# EAGLE design atxmega_e5_breakout_v1 (EAGLE 6.4)
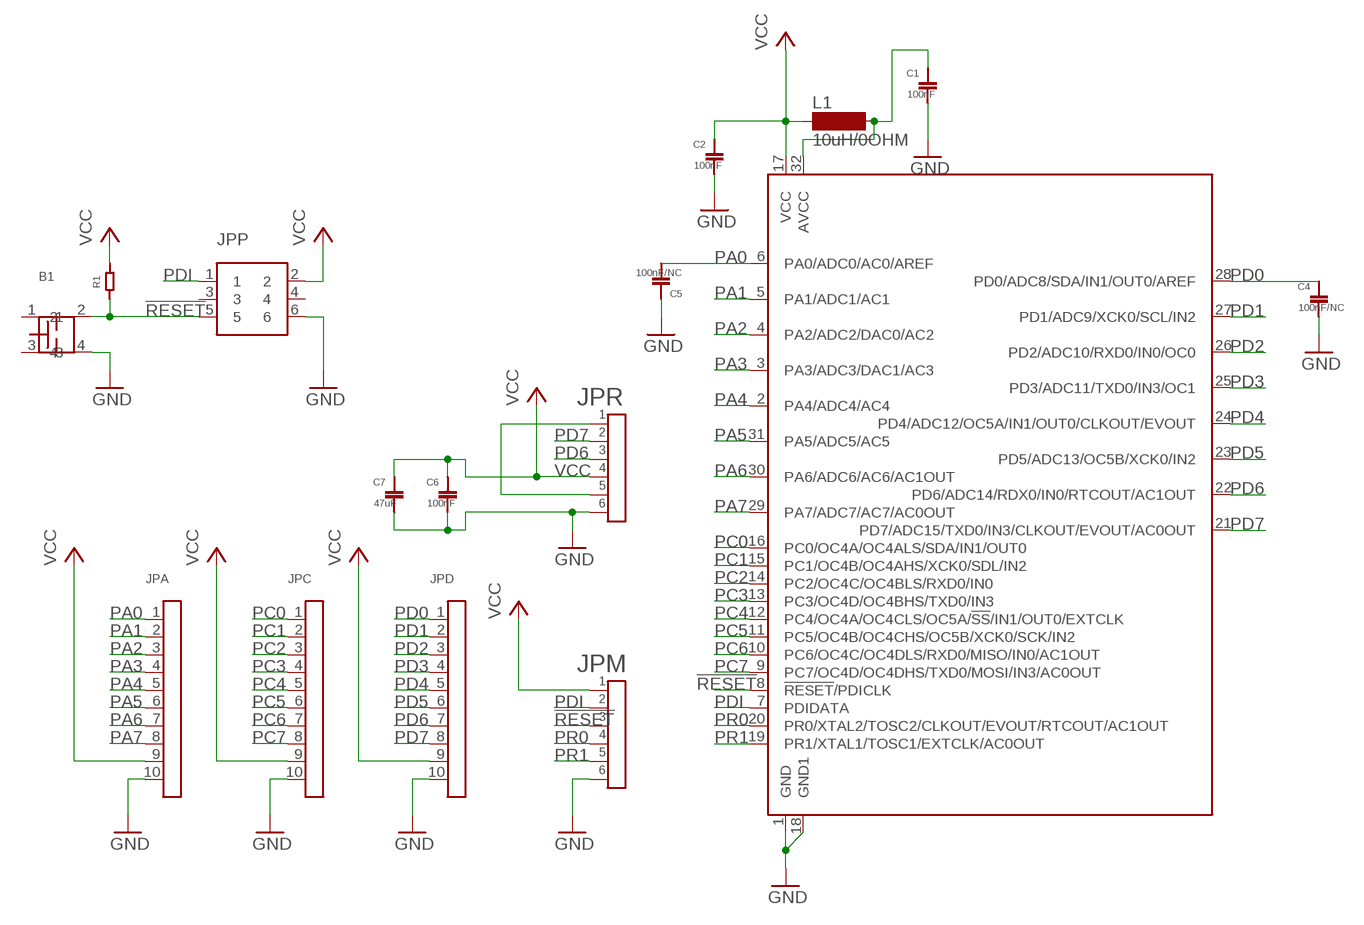
[diagram p0: schematic, sheet 1]

## Parts
B1  BUTTON_ALPS_5.2MM_SMD  [BUTTON_ALPS_SMD_5.2MM_SKQG]
C1  100nF  CAPACITOR0603  [0603]
C2  100nF  CAPACITOR0603  [0603]
C4  100nF/NC  CAPACITOR0603  [0603]
C5  100nF/NC  CAPACITOR0603  [0603]
C6  100nF  CAPACITOR0603  [0603]
C7  47uF  CAPACITOR1206  [1206]
JPA  PIN1X10PTH_S  [PIN_1X10_S]
JPC  PIN1X10PTH_S  [PIN_1X10_S]
JPD  PIN1X10PTH_S  [PIN_1X10_S]
JPM  PIN1X6PTH_SMALL  [PIN_1X6_S]
JPP  PIN2X3ALT_S  [PIN_2X3_ALT_S]
JPR  PIN1X6PTH_SMALL  [PIN_1X6_S]
L1  10uH/0OHM  SM-1206  [SM-1206]
R1  RESISTOR0603  [0603]
U1  ATXMEGAE5AU  [TQFP32]

## Nets
!RESET: B1.2 JPM.3 JPP.5 R1.1 U1.8(!RESET!/PDICLK)
AVCC: C1.2 L1.2 U1.32(AVCC)
GND: B1.4 C1.1 C2.1 C4.1 C5.2 C6.1 C7.2 JPA.10 JPC.10 JPD.10 JPM.6 JPP.6 JPR.6 U1.1(GND) U1.18(GND1)
N$12: JPR.1 JPR.5
PA0: C5.1 JPA.1 U1.6(PA0/ADC0/AC0/AREF)
PA1: JPA.2 U1.5(PA1/ADC1/AC1)
PA2: JPA.3 U1.4(PA2/ADC2/DAC0/AC2)
PA3: JPA.4 U1.3(PA3/ADC3/DAC1/AC3)
PA4: JPA.5 U1.2(PA4/ADC4/AC4)
PA5: JPA.6 U1.31(PA5/ADC5/AC5)
PA6: JPA.7 U1.30(PA6/ADC6/AC6/AC1OUT)
PA7: JPA.8 U1.29(PA7/ADC7/AC7/AC0OUT)
PC0: JPC.1 U1.16(PC0/OC4A/OC4ALS/SDA/IN1/OUT0)
PC1: JPC.2 U1.15(PC1/OC4B/OC4AHS/XCK0/SDL/IN2)
PC2: JPC.3 U1.14(PC2/OC4C/OC4BLS/RXD0/IN0)
PC3: JPC.4 U1.13(PC3/OC4D/OC4BHS/TXD0/IN3)
PC4: JPC.5 U1.12(PC4/OC4A/OC4CLS/OC5A/!SS!/IN1/OUT0/EXTCLK)
PC5: JPC.6 U1.11(PC5/OC4B/OC4CHS/OC5B/XCK0/SCK/IN2)
PC6: JPC.7 U1.10(PC6/OC4C/OC4DLS/RXD0/MISO/IN0/AC1OUT)
PC7: JPC.8 U1.9(PC7/OC4D/OC4DHS/TXD0/MOSI/IN3/AC0OUT)
PD0: C4.2 JPD.1 U1.28(PD0/ADC8/SDA/IN1/OUT0/AREF)
PD1: JPD.2 U1.27(PD1/ADC9/XCK0/SCL/IN2)
PD2: JPD.3 U1.26(PD2/ADC10/RXD0/IN0/OC0)
PD3: JPD.4 U1.25(PD3/ADC11/TXD0/IN3/OC1)
PD4: JPD.5 U1.24(PD4/ADC12/OC5A/IN1/OUT0/CLKOUT/EVOUT)
PD5: JPD.6 U1.23(PD5/ADC13/OC5B/XCK0/IN2)
PD6: JPD.7 JPR.3 U1.22(PD6/ADC14/RDX0/IN0/RTCOUT/AC1OUT)
PD7: JPD.8 JPR.2 U1.21(PD7/ADC15/TXD0/IN3/CLKOUT/EVOUT/AC0OUT)
PDI: JPM.2 JPP.1 U1.7(PDIDATA)
PR0: JPM.4 U1.20(PR0/XTAL2/TOSC2/CLKOUT/EVOUT/RTCOUT/AC1OUT)
PR1: JPM.5 U1.19(PR1/XTAL1/TOSC1/EXTCLK/AC0OUT)
VCC: C2.2 C6.2 C7.1 JPA.9 JPC.9 JPD.9 JPM.1 JPP.2 JPR.4 L1.1 R1.2 U1.17(VCC)
Unconnected: B1.1 B1.3 JPP.3 JPP.4

## Library data of the parts
B1 = 01jyd:BUTTON_ALPS_5.2MM_SMD
C1 C2 C4-C7 = 01jyd:CAPACITOR
JPA JPC JPD = 01jyd:PIN1X10
JPM JPR = 01jyd:PIN1X6
JPP = 01jyd:PIN2X3
L1 = inductor-neosid:SM-1206: INDUCTOR SMD chip inductor; OC_FARNELL: unknown; OC_NEWARK: unknown
R1 = 01jyd:RESISTOR
U1 = 01jyd:ATXMEGAE5

## Board
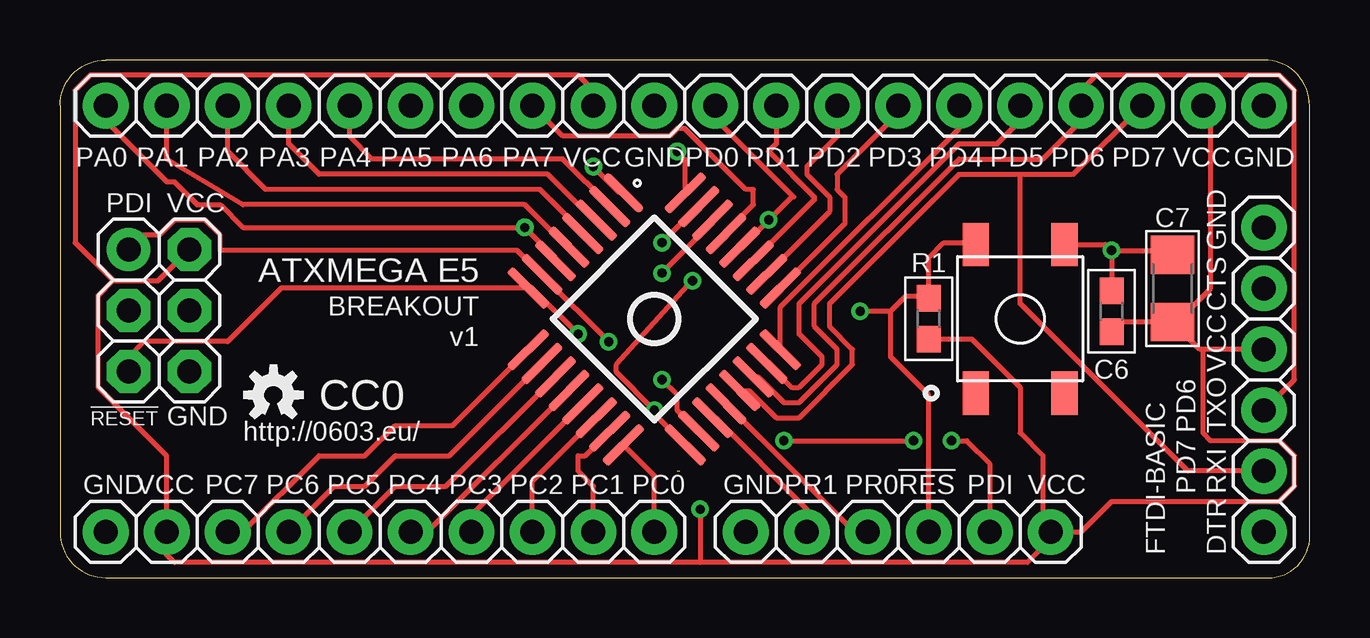
[diagram p1: board, top side]
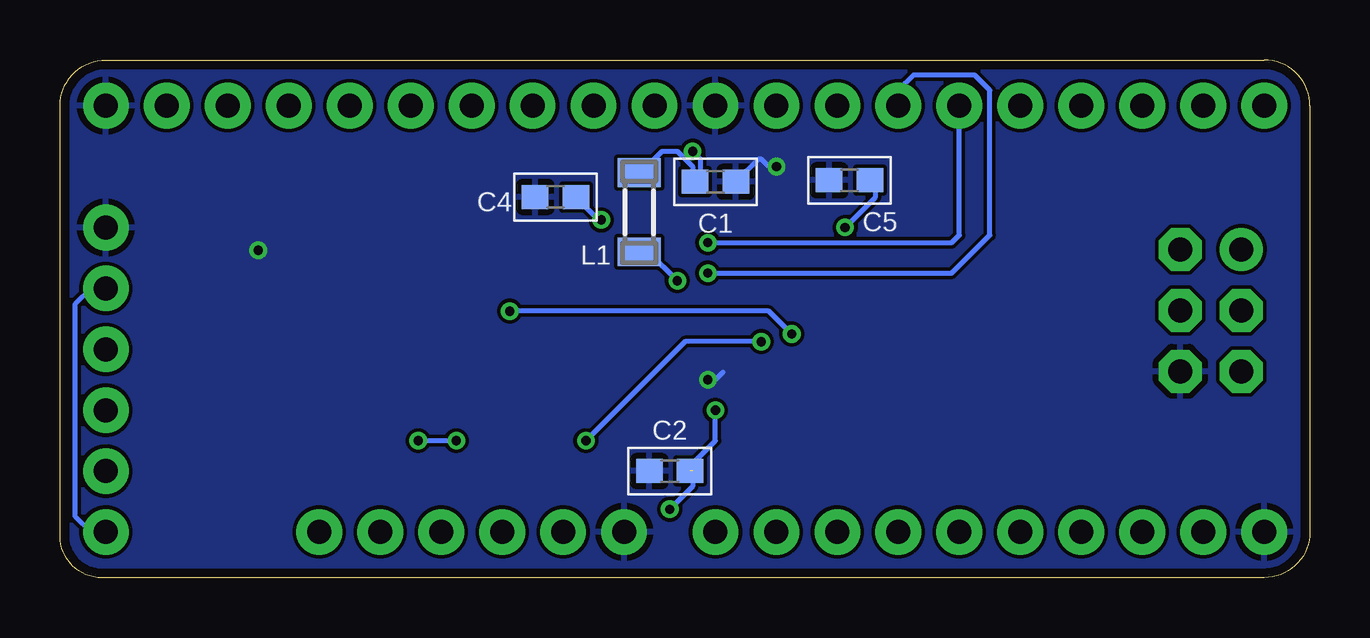
[diagram p2: board, bottom side, seen from below]

Size 52.08 x 21.6 mm. Coordinates in mm from the lower left corner, seen from the top.
Outline: 1.91,0.01 50.16,0.01 arc100 52.07,1.91 52.07,19.69 arc90 50.16,21.6 1.91,21.6 arc90 0,19.69 0,1.91 arc90 1.91,0.01
Copper layers (1*16): Top 0.0356mm / dielectric 1.5011mm / Bottom 0.0356mm
Design rules "LaenPCBOrder *": minimum track width 6mil, minimum drill 13mil, track to track 6mil, track to pad 6mil, pad to pad 6mil, via to via 6mil, smd to smd 6mil, copper to edge 15mil, drill to drill 6mil, minimum pad ring 7mil, minimum via ring 7mil, stop-mask expansion 4mil, vias tented up to drill 16mil, thermal gap 10mil

### Footprints (pad centres in the part's own frame; a part is rotated, then mirrored left to right if it is on the bottom)
BUTTON_ALPS_SMD_5.2MM_SKQG = smd 1.8 x 1.1: 1 -3.1,1.85; 2 3.1,1.85; 3 -3.1,-1.85; 4 3.1,-1.85
0603 = smd 1.1 x 1: 1 -0.85,0; 2 0.85,0
1206 = smd 1.6 x 1.8: 1 -1.4,0; 2 1.4,0
PIN_1X10_S = drill 1 pad 1.906: 1 0,11.43; 2 0,8.89; 3 0,6.35; 4 0,3.81; 5 0,1.27; 6 0,-1.27; 7 0,-3.81; 8 0,-6.35; 9 0,-8.89; 10 0,-11.43
PIN_1X6_S = drill 1 pad 1.906: 1 0,6.35; 2 0,3.81; 3 0,1.27; 4 0,-1.27; 5 0,-3.81; 6 0,-6.35
PIN_2X3_ALT_S = drill 1 pad 1.8: 1 -1.27,2.54 | drill 1 pad 1.8 octagon: 2 1.27,2.54; 3 -1.27,0; 4 1.27,0; 5 -1.27,-2.54; 6 1.27,-2.54
SM-1206 = smd 1.2 x 1.8: 1 -1.65,0; 2 1.65,0
TQFP32 = smd 2.17 x 0.36: 1 -4.625,2.8; 2 -4.625,2; 3 -4.625,1.2; 4 -4.625,0.4; 5 -4.625,-0.4; 6 -4.625,-1.2; 7 -4.625,-2; 8 -4.625,-2.8; 17 4.625,-2.8; 18 4.625,-2; 19 4.625,-1.2; 20 4.625,-0.4; 21 4.625,0.4; 22 4.625,1.2; 23 4.625,2; 24 4.625,2.8 | smd 0.36 x 2.17: 9 -2.8,-4.625; 10 -2,-4.625; 11 -1.2,-4.625; 12 -0.4,-4.625; 13 0.4,-4.625; 14 1.2,-4.625; 15 2,-4.625; 16 2.8,-4.625; 25 2.8,4.625; 26 2,4.625; 27 1.2,4.625; 28 0.4,4.625; 29 -0.4,4.625; 30 -1.2,4.625; 31 -2,4.625; 32 -2.8,4.625

### Placement (x,y rotation side)
B1  40.01,10.8 90 top
C1  24.77,16.52 180 bottom
C2  26.67,4.45 0 bottom
C4  31.43,15.88 0 bottom
C5  19.18,16.58 180 bottom
C6  43.81,11.12 270 top
C7  46.35,12.07 90 top
JPA  13.34,19.69 90 top
JPC  13.34,1.91 270 top
JPD  38.73,19.69 90 top
JPM  34.92,1.91 270 top
JPP  4.12,11.15 0 top
JPR  50.16,8.26 180 top
L1  27.94,15.25 90 bottom
R1  36.2,10.8 270 top
U1  24.77,10.8 315 top

### Tracks (layer width: path | path; a pad name or v marks a point on that pad's centre or on a via)
!RESET  (via drill 0.38)
  Top 0.203: JPP.5 2.86,9.21 3.49,9.85 6.99,9.85 9.23,12.09 U1.8 19.66,12.09 v21.59,10.17 | JPM.3 36.2,7.63 34.61,9.21 34.61,11.12 | 34.61,11.12 35.24,11.76 36.09,11.76 R1.1 36.2,13.34 36.83,13.98 38.08,13.98 B1.2 | v33.34,11.12 34.61,11.12
  Bottom 0.203: v21.59,10.17 22.54,11.12 v33.34,11.12
AVCC  (via drill 0.38)
  Top 0.203: U1.32 26.05,17.45 v25.72,17.79
  Bottom 0.203: L1.2 27.88,16.9 26.99,17.79 26.35,17.79 25.72,17.15 25.72,16.62 C1.2 25.4,16.73 25.4,17.47 v25.72,17.79
GND  (via drill 0.38)
  Top 0.203: U1.18 26.59,6.12 25.72,6.99 25.72,7.63 v25.08,8.26 | U1.1 23.32,16.05 v22.23,17.15 | B1.4 43.57,13.9 v43.81,13.66 | v43.81,13.66 C6.1 | v43.81,13.66 46.17,13.66 C7.2
  Bottom 0.203: v25.08,8.26 24.77,8.26 24.45,8.58 | v22.23,17.15 22.54,17.15 22.86,17.47 22.96,17.47 C1.1
  pour Bottom: 0,21.6 52.07,21.6 52.07,0.01 0,0.01
N$1
  Top 0.005: 9.22,6.82 arc9 9.35,6.89 9.67,6.63 9.89,6.85 9.63,7.16 arc19 9.74,7.43 10.15,7.47 10.15,7.78 9.74,7.82 arc19 9.63,8.09 9.89,8.41 9.67,8.63 9.35,8.37 arc19 9.09,8.48 9.04,8.89 8.73,8.89 8.69,8.48 arc19 8.43,8.37 8.11,8.63 7.89,8.41 8.15,8.09 arc19 8.04,7.82 7.63,7.78 7.63,7.47 8.04,7.43 arc19 8.15,7.16 7.89,6.85 8.11,6.63 8.43,6.89 arc9 8.56,6.82 8.74,7.26 arc-68 8.49,7.63 arc-247 9.04,7.26 9.22,6.82
N$12
  Bottom 0.203: JPR.1 50.8,1.91 51.44,2.55 51.44,11.44 50.8,12.07 JPR.5
PA0  (via drill 0.38)
  Top 0.203: U1.6 20.65,13.33 v19.37,14.61 7.62,14.61 6.67,15.56 5.71,15.56 4.76,16.52 4.45,16.52 1.91,19.06 JPA.1
  Bottom 0.203: v19.37,14.61 18.1,15.88 18.1,16.35 C5.1
PA1
  Top 0.203: U1.5 21.14,13.79 19.37,15.56 7.62,15.56 4.45,17.47 JPA.2
PA2
  Top 0.203: U1.4 21.78,14.43 20,16.2 8.57,16.2 6.99,17.79 JPA.3
PA3
  Top 0.203: U1.3 22.23,14.92 20.32,16.84 10.79,16.84 9.53,18.11 JPA.4
PA4
  Top 0.203: U1.2 22.91,15.52 20.95,17.47 13.02,17.47 12.06,18.42 JPA.5
PA5  (via drill 0.38)
  Top 0.203: U1.31 26.59,15.49 v25.08,13.98
  Bottom 0.203: v25.08,13.98 14.92,13.98 14.61,14.29 JPA.6
PA6  (via drill 0.38)
  Top 0.203: U1.30 27.19,14.81 v25.08,12.71
  Bottom 0.203: v25.08,12.71 14.92,12.71 13.34,14.29 13.34,20.33 13.97,20.96 16.51,20.96 17.14,20.33 JPA.7
PA7
  Top 0.203: U1.29 27.75,14.43 28.89,15.56 28.89,16.2 28.57,16.2 26.04,18.74 25.72,18.74 25.4,18.42 20.95,18.42 JPA.8
PC0
  Top 0.203: JPC.1 24.77,4.26 U1.16
PC1
  Top 0.203: JPC.2 22.23,3.82 21.59,4.45 21.59,5.09 21.88,5.09 U1.15
PC2
  Top 0.203: JPC.3 19.68,4.03 U1.14
PC3
  Top 0.203: JPC.4 17.14,2.62 U1.13
PC4
  Top 0.203: JPC.5 15.31,1.91 U1.12
PC5
  Top 0.203: JPC.6 13.97,3.82 16.08,3.82 U1.11
PC6
  Top 0.203: JPC.7 11.43,3.82 12.7,3.82 13.97,5.09 16.22,5.09 U1.10
PC7
  Top 0.203: JPC.8 7.62,1.91 10.79,5.09 12.7,5.09 13.97,6.36 16.36,6.36 U1.9
PD0  (via drill 0.38)
  Top 0.203: U1.28 28.39,13.79 v29.53,14.93 30.48,15.88 C4.2 27.3,19.16 JPD.1
  Bottom 0.203: v29.53,14.93 29.63,14.93 C4.2
PD1
  Top 0.203: JPD.2 29.84,18.11 29.53,17.79 31.43,15.88 31.43,15.77 U1.27
PD2
  Top 0.203: JPD.3 32.38,18.42 31.11,17.15 31.11,16.84 32.07,15.88 32.07,15.28 U1.26
PD3
  Top 0.203: JPD.4 34.92,19.37 32.38,16.84 32.38,16.2 32.7,15.88 32.7,14.78 U1.25
PD4
  Top 0.203: U1.24 30.02,11.29 37.47,18.74 JPD.5
PD5
  Top 0.203: U1.23 29.48,8.95 30.48,7.95 30.8,7.95 31.75,8.9 31.75,9.21 30.8,10.17 30.8,11.44 37.47,18.11 39.05,18.11 40.01,19.06 JPD.6
PD6
  Top 0.203: U1.22 29.09,8.38 30.16,7.31 30.8,7.31 32.38,8.9 32.38,9.53 31.43,10.48 31.43,11.44 37.47,17.47 40.96,17.47 42.55,19.06 JPD.7 42.55,20.33 43.18,20.96 50.8,20.96 51.44,20.33 51.44,8.26 JPR.3
PD7
  Top 0.203: U1.21 28.7,7.81 29.84,6.68 30.8,6.68 33.02,8.9 33.02,9.53 32.07,10.48 32.07,11.44 37.47,16.84 40.01,16.84 | 40.01,16.84 42.23,16.84 JPD.8 | JPR.2 46.99,4.45 40.01,11.44 40.01,16.84
PDI  (via drill 0.38)
  Top 0.203: v22.86,9.85 20.08,12.63 U1.7 20.05,12.66 19.05,13.66 6.67,13.66 6.67,14.29 6.03,14.93 4.76,14.93 4.13,14.29 3.46,14.29 JPP.1 | v30.16,5.72 v35.56,5.72 | v37.15,5.72 37.78,5.72 38.73,4.77 JPM.2
  Bottom 0.203: v22.86,9.85 26.04,9.85 v30.16,5.72 | v35.56,5.72 v37.15,5.72
PR0
  Top 0.203: JPM.4 33.09,1.91 U1.20
PR1
  Top 0.203: U1.19 27.3,6.68 31.11,2.86 JPM.5
VCC  (via drill 0.38)  (1 unrouted)
  Top 0.203: U1.17 24.77,6.84 v24.77,6.99 23.18,8.58 23.18,8.9 v26.35,12.39 | 2.22,12.39 1.59,11.76 1.59,7.95 4.45,5.09 JPC.9 4.45,0.96 4.76,0.64 26.67,0.64 | 2.22,12.39 4.09,12.39 JPP.2 | JPA.9 22.23,20.33 21.59,20.96 1.27,20.96 0.64,20.33 0.64,13.98 2.22,12.39 | JPM.1 41.27,1.59 40.32,0.64 26.67,0.64 | JPR.4 47.62,9.53 | 47.62,9.53 47.49,9.53 C7.1 | C7.1 44.22,10.67 C6.2 | C7.1 46.54,10.67 47.94,12.07 47.94,19.37 JPD.9 | JPM.1 42.55,1.91 43.81,3.18 50.8,3.18 51.44,3.82 51.44,5.09 50.8,5.72 47.94,5.72 47.62,6.04 47.62,9.53 | R1.2 38,9.95 40.01,7.95 40.01,6.04 40.96,5.09 40.96,2.23 JPM.1 | v26.67,2.86 26.67,0.64
  Bottom 0.203: C2.2 25.82,4.67 24.77,5.72 v24.77,6.99 | L1.1 27.56,13.6 v26.35,12.39 | 25.72,4.45 25.72,3.82 v26.67,2.86

### Text on the board
tPlace: PA0 | PA1 | PA2 | PA3 | PA4 | PA5 | PA6 | PA7 | VCC | GND | PD0 | PD1 | PD2 | PD3 | PD4 | PD5 | PD6 | PD7 | VCC | GND | PDI | VCC | GND | ATXMEGA E5 | BREAKOUT | CTS | v1 | VCC | CC0 | !RESET | GND | http://0603.eu/ | PD6 | TXO | GND | VCC | PC7 | PC6 | PC5 | PC4 | PC3 | PC2 | PC1 | PC0 | GND | PR1 | PR0 | !RES | PDI | VCC | PD7 | RXI | FTDI-BASIC | DTR